# Altium schematic sheet Sheet_1_2024-08-25.schdoc
size 645 x 144 mm
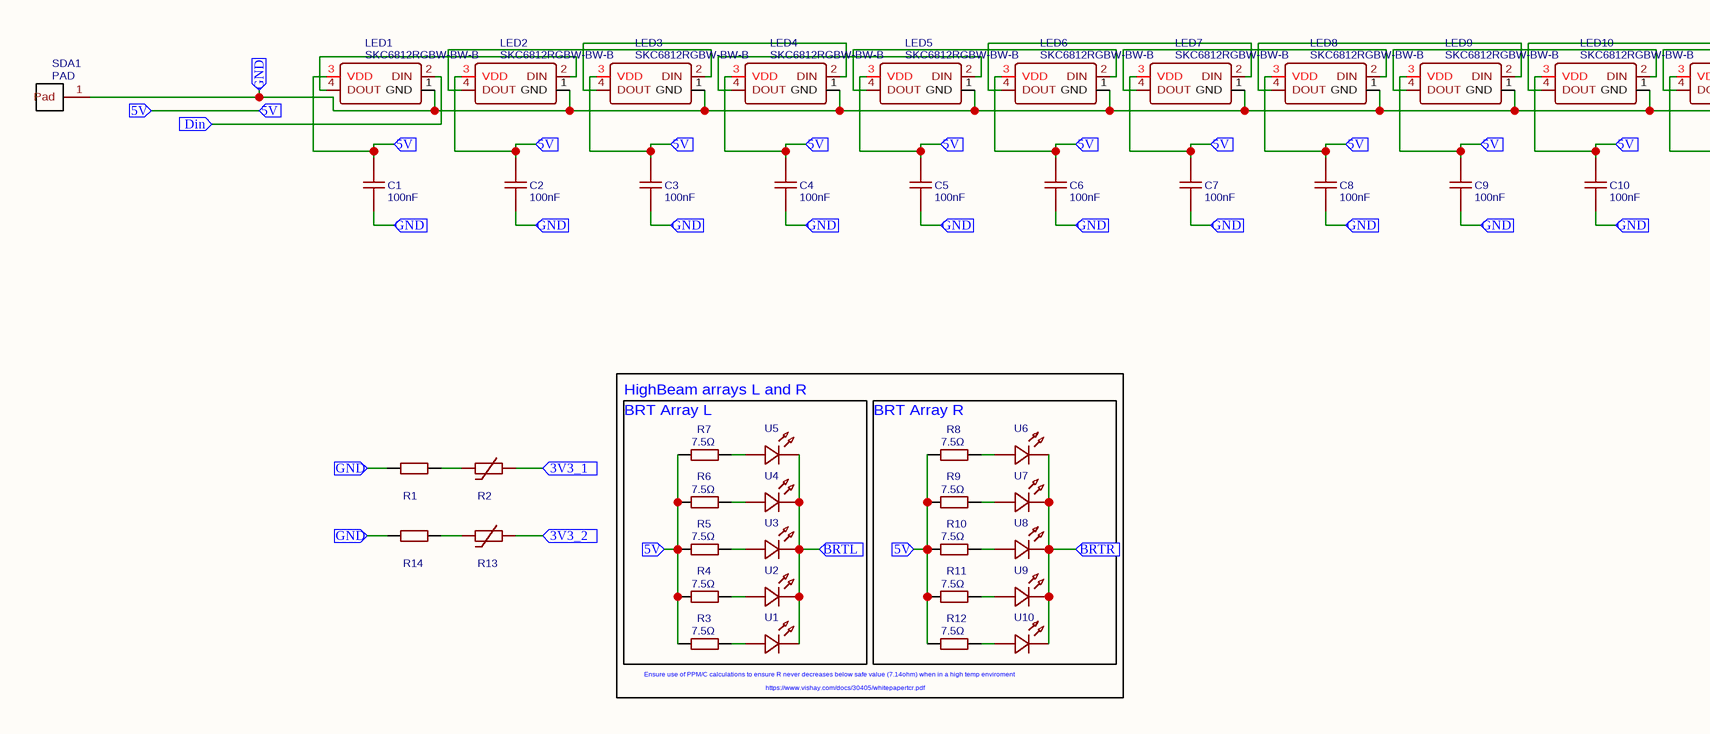
[diagram p0: Sheet_1_2024-08-25.schdoc, left]
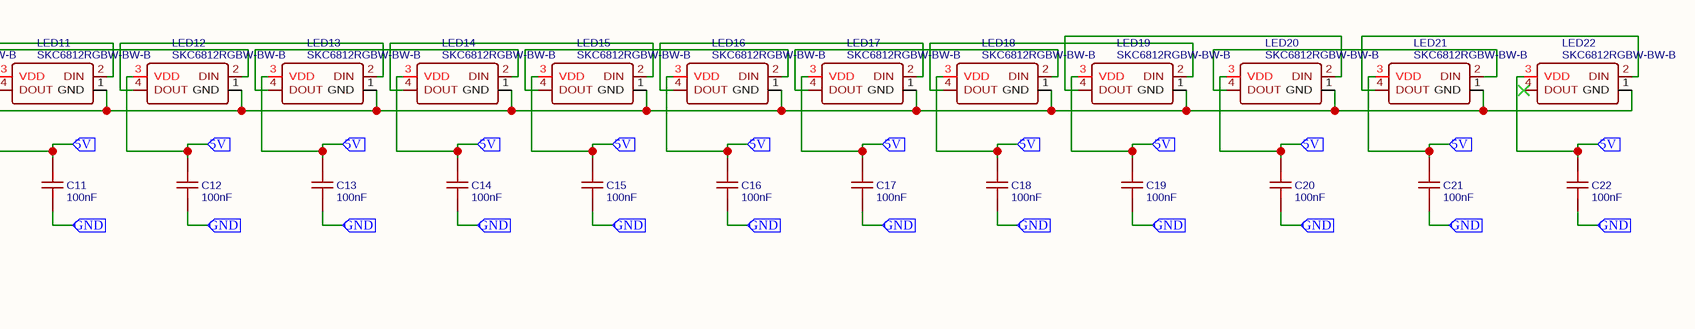
[diagram p1: Sheet_1_2024-08-25.schdoc, right]

## Parts
C1  100nF  [C0402]
C2  100nF  [C0402]
C3  100nF  [C0402]
C4  100nF  [C0402]
C5  100nF  [C0402]
C6  100nF  [C0402]
C7  100nF  [C0402]
C8  100nF  [C0402]
C9  100nF  [C0402]
C10  100nF  [C0402]
C11  100nF  [C0402]
C12  100nF  [C0402]
C13  100nF  [C0402]
C14  100nF  [C0402]
C15  100nF  [C0402]
C16  100nF  [C0402]
C17  100nF  [C0402]
C18  100nF  [C0402]
C19  100nF  [C0402]
C20  100nF  [C0402]
C21  100nF  [C0402]
C22  100nF  [C0402]
LED1  SKC6812RGBW-BW-B  [LED-SMD_4P-L5.0-W5.0-TL-2]
LED2  SKC6812RGBW-BW-B  [LED-SMD_4P-L5.0-W5.0-TL-2]
LED3  SKC6812RGBW-BW-B  [LED-SMD_4P-L5.0-W5.0-TL-2]
LED4  SKC6812RGBW-BW-B  [LED-SMD_4P-L5.0-W5.0-TL-2]
LED5  SKC6812RGBW-BW-B  [LED-SMD_4P-L5.0-W5.0-TL-2]
LED6  SKC6812RGBW-BW-B  [LED-SMD_4P-L5.0-W5.0-TL-2]
LED7  SKC6812RGBW-BW-B  [LED-SMD_4P-L5.0-W5.0-TL-2]
LED8  SKC6812RGBW-BW-B  [LED-SMD_4P-L5.0-W5.0-TL-2]
LED9  SKC6812RGBW-BW-B  [LED-SMD_4P-L5.0-W5.0-TL-2]
LED10  SKC6812RGBW-BW-B  [LED-SMD_4P-L5.0-W5.0-TL-2]
LED11  SKC6812RGBW-BW-B  [LED-SMD_4P-L5.0-W5.0-TL-2]
LED12  SKC6812RGBW-BW-B  [LED-SMD_4P-L5.0-W5.0-TL-2]
LED13  SKC6812RGBW-BW-B  [LED-SMD_4P-L5.0-W5.0-TL-2]
LED14  SKC6812RGBW-BW-B  [LED-SMD_4P-L5.0-W5.0-TL-2]
LED15  SKC6812RGBW-BW-B  [LED-SMD_4P-L5.0-W5.0-TL-2]
LED16  SKC6812RGBW-BW-B  [LED-SMD_4P-L5.0-W5.0-TL-2]
LED17  SKC6812RGBW-BW-B  [LED-SMD_4P-L5.0-W5.0-TL-2]
LED18  SKC6812RGBW-BW-B  [LED-SMD_4P-L5.0-W5.0-TL-2]
LED19  SKC6812RGBW-BW-B  [LED-SMD_4P-L5.0-W5.0-TL-2]
LED20  SKC6812RGBW-BW-B  [LED-SMD_4P-L5.0-W5.0-TL-2]
LED21  SKC6812RGBW-BW-B  [LED-SMD_4P-L5.0-W5.0-TL-2]
LED22  SKC6812RGBW-BW-B  [LED-SMD_4P-L5.0-W5.0-TL-2]
R1  100kΩ  [R0603]  (value not drawn)
R2  SDNT1608X104F3950FTF  [R0603]  (value not drawn)
R3  7.5Ω  [R2512]
R4  7.5Ω  [R2512]
R5  7.5Ω  [R2512]
R6  7.5Ω  [R2512]
R7  7.5Ω  [R2512]
R8  7.5Ω  [R2512]
R9  7.5Ω  [R2512]
R10  7.5Ω  [R2512]
R11  7.5Ω  [R2512]
R12  7.5Ω  [R2512]
R13  SDNT1608X104F3950FTF  [R0603]  (value not drawn)
R14  100kΩ  [R0603]  (value not drawn)
SDA1  PAD  [VIA PAD THING]
U1  JNJ-LTJH0111W60/26MIL/8000-9000K  [LED-SMD_L3.5-W2.8_1]  (value not drawn)
U2  JNJ-LTJH0111W60/26MIL/8000-9000K  [LED-SMD_L3.5-W2.8_1]  (value not drawn)
U3  JNJ-LTJH0111W60/26MIL/8000-9000K  [LED-SMD_L3.5-W2.8_1]  (value not drawn)
U4  JNJ-LTJH0111W60/26MIL/8000-9000K  [LED-SMD_L3.5-W2.8_1]  (value not drawn)
U5  JNJ-LTJH0111W60/26MIL/8000-9000K  [LED-SMD_L3.5-W2.8_1]  (value not drawn)
U6  JNJ-LTJH0111W60/26MIL/8000-9000K  [LED-SMD_L3.5-W2.8_1]  (value not drawn)
U7  JNJ-LTJH0111W60/26MIL/8000-9000K  [LED-SMD_L3.5-W2.8_1]  (value not drawn)
U8  JNJ-LTJH0111W60/26MIL/8000-9000K  [LED-SMD_L3.5-W2.8_1]  (value not drawn)
U9  JNJ-LTJH0111W60/26MIL/8000-9000K  [LED-SMD_L3.5-W2.8_1]  (value not drawn)
U10  JNJ-LTJH0111W60/26MIL/8000-9000K  [LED-SMD_L3.5-W2.8_1]  (value not drawn)

## Blocks framed on the sheet
BRT Array R: R8-R12 U6-U10

## Ports
3V3_1 (in), 3V3_2 (in), 5V (in), BRTL (in), BRTR (in), Din (in), GND (in)

## Nets
3V3_1: R2.2 ; port 3V3_1
3V3_2: R13.2 ; port 3V3_2
5V: C1.2 C2.2 C3.2 C4.2 C5.2 C6.2 C7.2 C8.2 C9.2 C10.2 C11.2 C12.2 C13.2 C14.2 C15.2 C16.2 C17.2 C18.2 C19.2 C20.2 C21.2 C22.2 LED1.3(VDD) LED2.3(VDD) LED3.3(VDD) LED4.3(VDD) LED5.3(VDD) LED6.3(VDD) LED7.3(VDD) LED8.3(VDD) LED9.3(VDD) LED10.3(VDD) LED11.3(VDD) LED12.3(VDD) LED13.3(VDD) LED14.3(VDD) LED15.3(VDD) LED16.3(VDD) LED17.3(VDD) LED18.3(VDD) LED19.3(VDD) LED20.3(VDD) LED21.3(VDD) LED22.3(VDD) R3.1 R4.1 R5.1 R6.1 R7.1 R8.1 R9.1 R10.1 R11.1 R12.1 ; port 5V
BRTL: U1.2(K) U2.2(K) U3.2(K) U4.2(K) U5.2(K) ; port BRTL
BRTR: U6.2(K) U7.2(K) U8.2(K) U9.2(K) U10.2(K) ; port BRTR
Din: LED1.2(DIN) ; port Din
GND: C1.1 C2.1 C3.1 C4.1 C5.1 C6.1 C7.1 C8.1 C9.1 C10.1 C11.1 C12.1 C13.1 C14.1 C15.1 C16.1 C17.1 C18.1 C19.1 C20.1 C21.1 C22.1 LED1.1(GND) LED2.1(GND) LED3.1(GND) LED4.1(GND) LED5.1(GND) LED6.1(GND) LED7.1(GND) LED8.1(GND) LED9.1(GND) LED10.1(GND) LED11.1(GND) LED12.1(GND) LED13.1(GND) LED14.1(GND) LED15.1(GND) LED16.1(GND) LED17.1(GND) LED18.1(GND) LED19.1(GND) LED20.1(GND) LED21.1(GND) LED22.1(GND) R1.1 R14.1 SDA1.1(Pad) ; port GND
NetLED1_4: LED1.4(DOUT) LED2.2(DIN)
NetLED2_4: LED2.4(DOUT) LED3.2(DIN)
NetLED3_4: LED3.4(DOUT) LED4.2(DIN)
NetLED4_4: LED4.4(DOUT) LED5.2(DIN)
NetLED5_4: LED5.4(DOUT) LED6.2(DIN)
NetLED6_4: LED6.4(DOUT) LED7.2(DIN)
NetLED7_4: LED7.4(DOUT) LED8.2(DIN)
NetLED8_4: LED8.4(DOUT) LED9.2(DIN)
NetLED9_4: LED9.4(DOUT) LED10.2(DIN)
NetLED10_4: LED10.4(DOUT) LED11.2(DIN)
NetLED11_4: LED11.4(DOUT) LED12.2(DIN)
NetLED12_4: LED12.4(DOUT) LED13.2(DIN)
NetLED13_4: LED13.4(DOUT) LED14.2(DIN)
NetLED14_4: LED14.4(DOUT) LED15.2(DIN)
NetLED15_4: LED15.4(DOUT) LED16.2(DIN)
NetLED16_4: LED16.4(DOUT) LED17.2(DIN)
NetLED17_4: LED17.4(DOUT) LED18.2(DIN)
NetLED18_4: LED18.4(DOUT) LED19.2(DIN)
NetLED19_4: LED19.4(DOUT) LED20.2(DIN)
NetLED20_4: LED20.4(DOUT) LED21.2(DIN)
NetLED21_4: LED21.4(DOUT) LED22.2(DIN)
NetR1_2: R1.2 R2.1
NetR3_2: R3.2 U1.1(A)
NetR4_2: R4.2 U2.1(A)
NetR5_2: R5.2 U3.1(A)
NetR6_2: R6.2 U4.1(A)
NetR7_2: R7.2 U5.1(A)
NetR8_2: R8.2 U6.1(A)
NetR9_2: R9.2 U7.1(A)
NetR10_2: R10.2 U8.1(A)
NetR11_2: R11.2 U9.1(A)
NetR12_2: R12.2 U10.1(A)
NetR13_1: R13.1 R14.2

Not connected (* = marked no-connect by the designer): LED22 4(DOUT)*

## Notes on the sheet
- (near R7) BRT Array L
- HighBeam arrays L and R
- Ensure use of PPM/C calculations to ensure R never decreases below safe value (7.14ohm) when in a high temp enviroment
- https://www.vishay.com/docs/30405/whitepapertcr.pdf

## Library data of the parts
C1-C22 = 100nF: Manufacturer: YAGEO(国巨); Manufacturer Part: CC0402KRX7R6BB104; nameAlias: Value; Contributor: LCSC; Supplier: LCSC; Supplier Part: C309458; JLCPCB Part Class: Extended Part; spicePre: C; spiceSymbolName: CC0402KRX7R6BB104
LED1-LED22 = SKC6812RGBW-BW-B: Manufacturer: 欧思科光电; Contributor: lcsc; Supplier: LCSC; Supplier Part: C5380878; Manufacturer Part: SKC6812RGBW-BW-B; JLCPCB Part Class: Extended Part; spicePre: L; spiceSymbolName: SKC6812RGBW-BW-B
R1 R14 = 100kΩ: Manufacturer: UNI-ROYAL(厚声); Manufacturer Part: 0603WAF1003T5E; nameAlias: Value; Supplier: LCSC; Supplier Part: C25803; JLCPCB Part Class: Basic Part; spicePre: R; spiceSymbolName: 0603WAF1003T5E
R2 R13 = SDNT1608X104F3950FTF: Manufacturer: Sunlord(顺络); Contributor: lcsc; Supplier: LCSC; Supplier Part: C919169; Manufacturer Part: SDNT1608X104F3950FTF; JLCPCB Part Class: Extended Part; spicePre: R; spiceSymbolName: SDNT1608X104F3950FTF
R3-R12 = 7.5Ω: Manufacturer: UNI-ROYAL(厚声); Manufacturer Part: 25121WF750KT4E; nameAlias: Value; Supplier: LCSC; Supplier Part: C35217; JLCPCB Part Class: Extended Part; spicePre: R; spiceSymbolName: 25121WF750KT4E
SDA1 = PAD: Contributor: edwardkeate; spicePre: U; spiceSymbolName: PAD
U1-U10 = JNJ-LTJH0111W60/26MIL/8000-9000K: Manufacturer: JNJ OPTOELECTRONICS(强生光电); Contributor: lcsc; Supplier: LCSC; Supplier Part: C7500127; Manufacturer Part: JNJ-LTJH0111W60/26mil/8000-9000K; JLCPCB Part Class: Extended Part; spicePre: U; spiceSymbolName: JNJ-LTJH0111W60/26MIL/8000-9000K